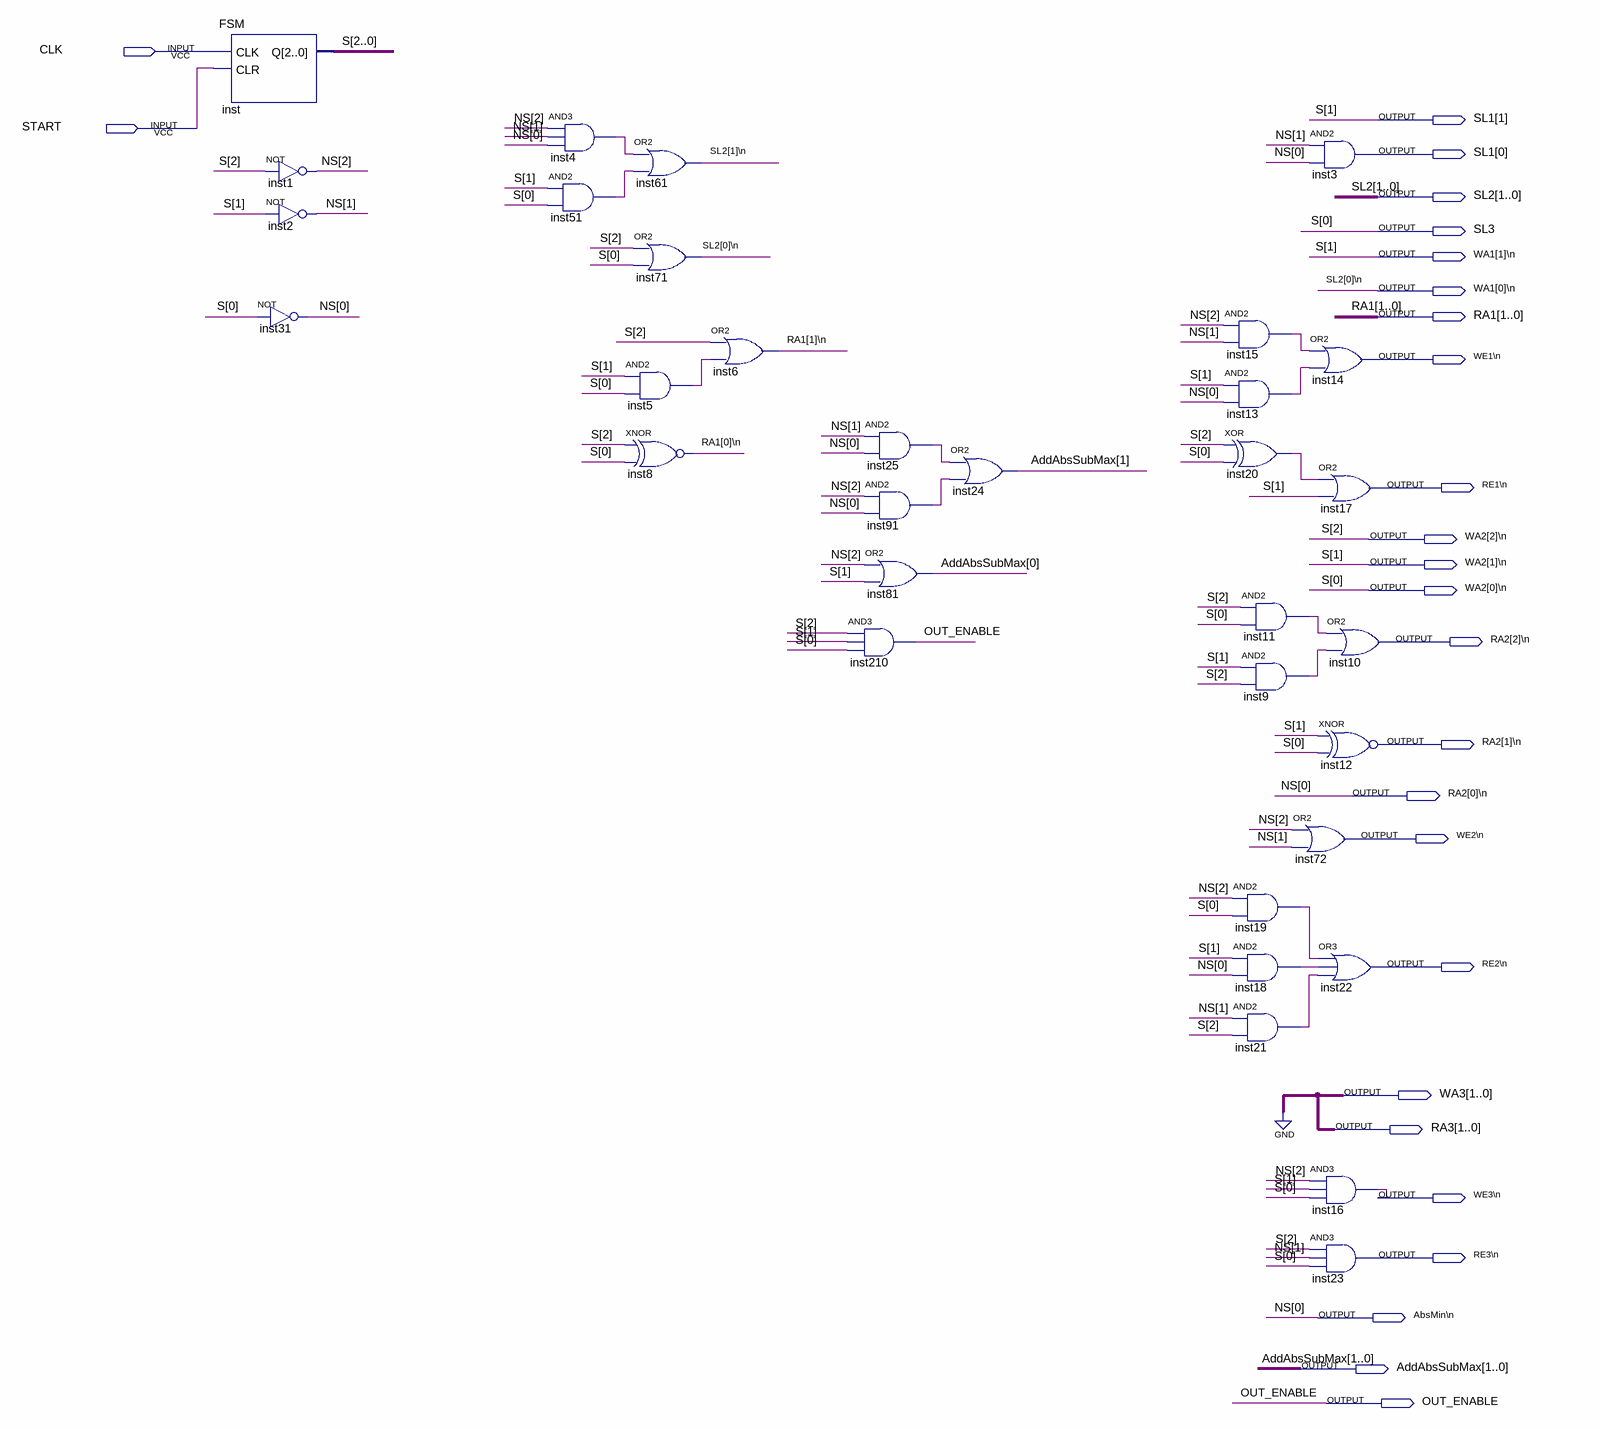
[diagram p0: schematic sheet]
// Quartus schematic DC_Controller.bdf as structural Verilog: 33 symbols, 26 pins
module DC_Controller (
  input  CLK,
  input  START,
  output [1:0] SL1,
  output [1:0] SL2,
  output SL3,
  output \WA1[1]\n ,
  output \WA1[0]\n ,
  output [1:0] RA1,
  output \WE1\n ,
  output \RE1\n ,
  output \WA2[2]\n ,
  output \WA2[1]\n ,
  output \WA2[0]\n ,
  output \RA2[2]\n ,
  output \RA2[1]\n ,
  output \RA2[0]\n ,
  output \WE2\n ,
  output \RE2\n ,
  output [1:0] WA3,
  output [1:0] RA3,
  output \WE3\n ,
  output \RE3\n ,
  output \AbsMin\n ,
  output [1:0] AddAbsSubMax,
  output OUT_ENABLE
);

  wire inst4_out, inst5_out, inst9_out, inst11_out, inst13_out, inst15_out, inst18_out, inst19_out,
       inst20_out, inst21_out, inst25_out, inst51_out, inst91_out, \RA1[0]\n , \RA1[1]\n , \SL2[1]\n ;
  wire [2:1] NS;

  FSM inst (.CLK(CLK), .CLR(START), .Q({\WA2[2]\n , SL1[1], SL3}));
  not inst1 (NS[2], \WA2[2]\n );
  not inst2 (NS[1], SL1[1]);
  not inst31 (\AbsMin\n , SL3);
  and inst4 (inst4_out, NS[2], NS[1], \AbsMin\n );
  and inst51 (inst51_out, SL1[1], SL3);
  or inst61 (\SL2[1]\n , inst4_out, inst51_out);
  or inst71 (\WA1[0]\n , \WA2[2]\n , SL3);
  and inst5 (inst5_out, SL1[1], SL3);
  xnor inst8 (\RA1[0]\n , \WA2[2]\n , SL3);
  or inst6 (\RA1[1]\n , \WA2[2]\n , inst5_out);
  and inst25 (inst25_out, NS[1], \AbsMin\n );
  and inst91 (inst91_out, NS[2], \AbsMin\n );
  or inst81 (AddAbsSubMax[0], NS[2], SL1[1]);
  and inst210 (OUT_ENABLE, \WA2[2]\n , SL1[1], SL3);
  or inst24 (AddAbsSubMax[1], inst25_out, inst91_out);
  and inst15 (inst15_out, NS[2], NS[1]);
  and inst13 (inst13_out, SL1[1], \AbsMin\n );
  xor inst20 (inst20_out, \WA2[2]\n , SL3);
  and inst11 (inst11_out, \WA2[2]\n , SL3);
  and inst9 (inst9_out, SL1[1], \WA2[2]\n );
  and inst19 (inst19_out, NS[2], SL3);
  and inst18 (inst18_out, SL1[1], \AbsMin\n );
  and inst21 (inst21_out, NS[1], \WA2[2]\n );
  and inst3 (SL1[0], NS[1], \AbsMin\n );
  or inst14 (\WE1\n , inst15_out, inst13_out);
  or inst17 (\RE1\n , inst20_out, SL1[1]);
  or inst10 (\RA2[2]\n , inst11_out, inst9_out);
  xnor inst12 (\RA2[1]\n , SL1[1], SL3);
  or inst72 (\WE2\n , NS[2], NS[1]);
  or inst22 (\RE2\n , inst19_out, inst18_out, inst21_out);
  and inst16 (\WE3\n , NS[2], SL1[1], SL3);
  and inst23 (\RE3\n , \WA2[2]\n , NS[1], SL3);

  assign \RA2[0]\n  = \AbsMin\n ;
  assign RA3 = 2'b00;
  assign \WA1[1]\n  = SL1[1];
  assign \WA2[0]\n  = SL3;
  assign \WA2[1]\n  = SL1[1];
  assign WA3 = 2'b00;

  // Other names for the same wires on the sheet: NS[0] = \AbsMin\n ; S[2:0] = {\WA2[2]\n , SL1[1], SL3};
  //   SL2[0]\n = \WA1[0]\n 
endmodule
